# Altium schematic sheet config.SchDoc: Test
size A4; Author: Łukasz Przeniosło; Organization: PRZENIOSLO; Address1: Electronics; Address2: &; Address3: Software; DocumentNumber: 3; Revision: 1.0; SheetNumber: 3; SheetTotal: 3
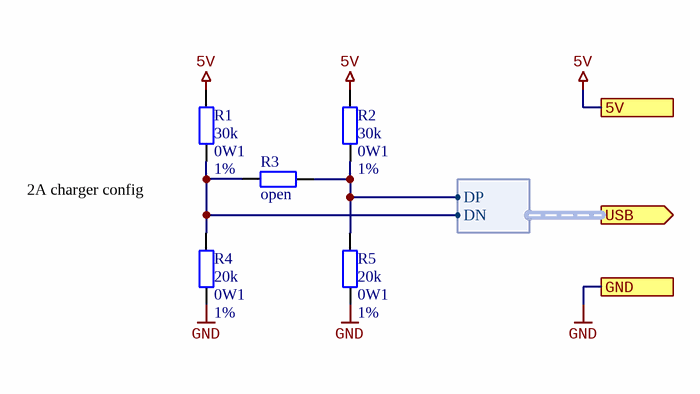
[diagram p0: config.SchDoc]

## Parts
R1  30k  Power: 0W1  Tolerance: 1%  [RESC1608N]
R2  30k  Power: 0W1  Tolerance: 1%  [RESC1608N]
R3  open  [RESC1608N]
R4  20k  Power: 0W1  Tolerance: 1%  [RESC1608N]
R5  20k  Power: 0W1  Tolerance: 1%  [RESC1608N]

## Ports
5V, GND, USB (out, harness USB)

## Harnesses
USB: DP, DN

## Nets
5V: R1.2 R2.2 ; port 5V
GND: R4.1 R5.1 ; port GND
NetR1_1: R1.1 R3.1 R4.2 ; port USB.DN
NetR2_1: R2.1 R3.2 R5.2 ; port USB.DP

## Notes on the sheet
- 2A charger config
- Title:
- Date:
- Author:
- Project:
- Time:
- Sheet
- of
- File:

## Library data of the parts
R1 R2 R4 R5 = Resistor
  R1 R2: Value: 30k
  R4 R5: Value: 20k
R3 = Resistor: Tolerance: 5%; Power: 0W; Value: open